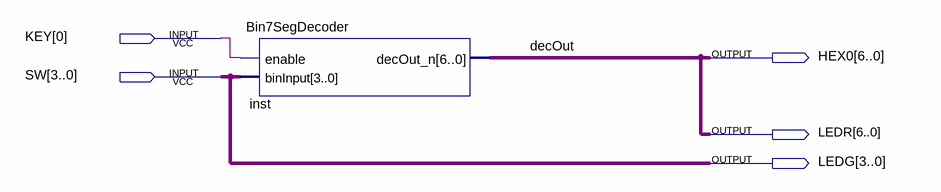
[diagram p0: schematic sheet]
// Quartus schematic DisplayDemo.bdf as structural Verilog: 1 symbols, 5 pins
module DisplayDemo (
  input  [0:0] KEY,
  input  [3:0] SW,
  output [6:0] HEX0,
  output [6:0] LEDR,
  output [3:0] LEDG
);

  wire decOut;

  Bin7SegDecoder inst (.enable(KEY[0]), .binInput(SW), .decOut_n(decOut));

  assign LEDG = SW;
  assign LEDR = HEX0;
endmodule
